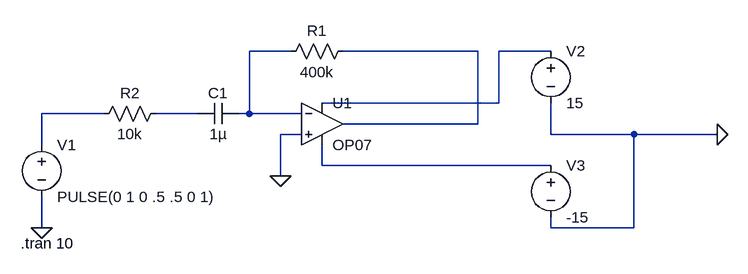
[diagram p0: schematic OPAMP_DIffrentiator.asc]
OPAMP_DIffrentiator.asc, the LTspice schematic file:
Version 4.1
SHEET 1 880 680
WIRE 80 48 16 48
WIRE 368 48 160 48
WIRE 480 48 400 48
WIRE 400 128 400 48
WIRE 400 128 128 128
WIRE -208 144 -304 144
WIRE -64 144 -128 144
WIRE 16 144 16 48
WIRE 16 144 0 144
WIRE 96 144 16 144
WIRE 368 160 368 48
WIRE 368 160 160 160
WIRE 96 176 64 176
WIRE 480 176 480 128
WIRE 608 176 480 176
WIRE 736 176 608 176
WIRE -304 192 -304 144
WIRE 128 224 128 192
WIRE 480 224 128 224
WIRE 64 240 64 176
WIRE -304 320 -304 272
WIRE 480 320 480 304
WIRE 608 320 608 176
WIRE 608 320 480 320
FLAG 64 240 0
FLAG -304 320 0
FLAG 736 176 0
SYMBOL OpAmps\\OP07 128 96 R0
SYMATTR InstName U1
SYMBOL cap 0 128 R90
WINDOW 0 0 32 VBottom 2
WINDOW 3 32 32 VTop 2
SYMATTR InstName C1
SYMATTR Value 1µ
SYMBOL res 176 32 R90
WINDOW 0 0 56 VBottom 2
WINDOW 3 32 56 VTop 2
SYMATTR InstName R1
SYMATTR Value 400k
SYMBOL res -224 160 R270
WINDOW 0 32 56 VTop 2
WINDOW 3 0 56 VBottom 2
SYMATTR InstName R2
SYMATTR Value 10k
SYMBOL voltage -304 176 R0
WINDOW 123 0 0 Left 0
WINDOW 39 0 0 Left 0
SYMATTR InstName V1
SYMATTR Value PULSE(0 1 0 .5 .5 0 1)
SYMBOL voltage 480 32 R0
WINDOW 123 0 0 Left 0
WINDOW 39 0 0 Left 0
SYMATTR InstName V2
SYMATTR Value 15
SYMBOL voltage 480 208 R0
WINDOW 123 0 0 Left 0
WINDOW 39 0 0 Left 0
SYMATTR InstName V3
SYMATTR Value -15
TEXT -336 344 Left 2 !.tran 10

The netlist it stands for:
* OPAMP_DIffrentiator.asc
X§U1 0 N001 N003 N006 N002 LT1001  ; OP07, pins In+ In- V+ V- OUT
C1 N001 N005 1µ
R1 N002 N001 400k
R2 N004 N005 10k
V1 N004 0 PULSE(0 1 0 .5 .5 0 1)
V2 N003 0 15
V3 N006 0 -15
.tran 10
.lib LTC.lib
.backanno
.end